# Altium schematic sheet Sheet1.SchDoc
size B
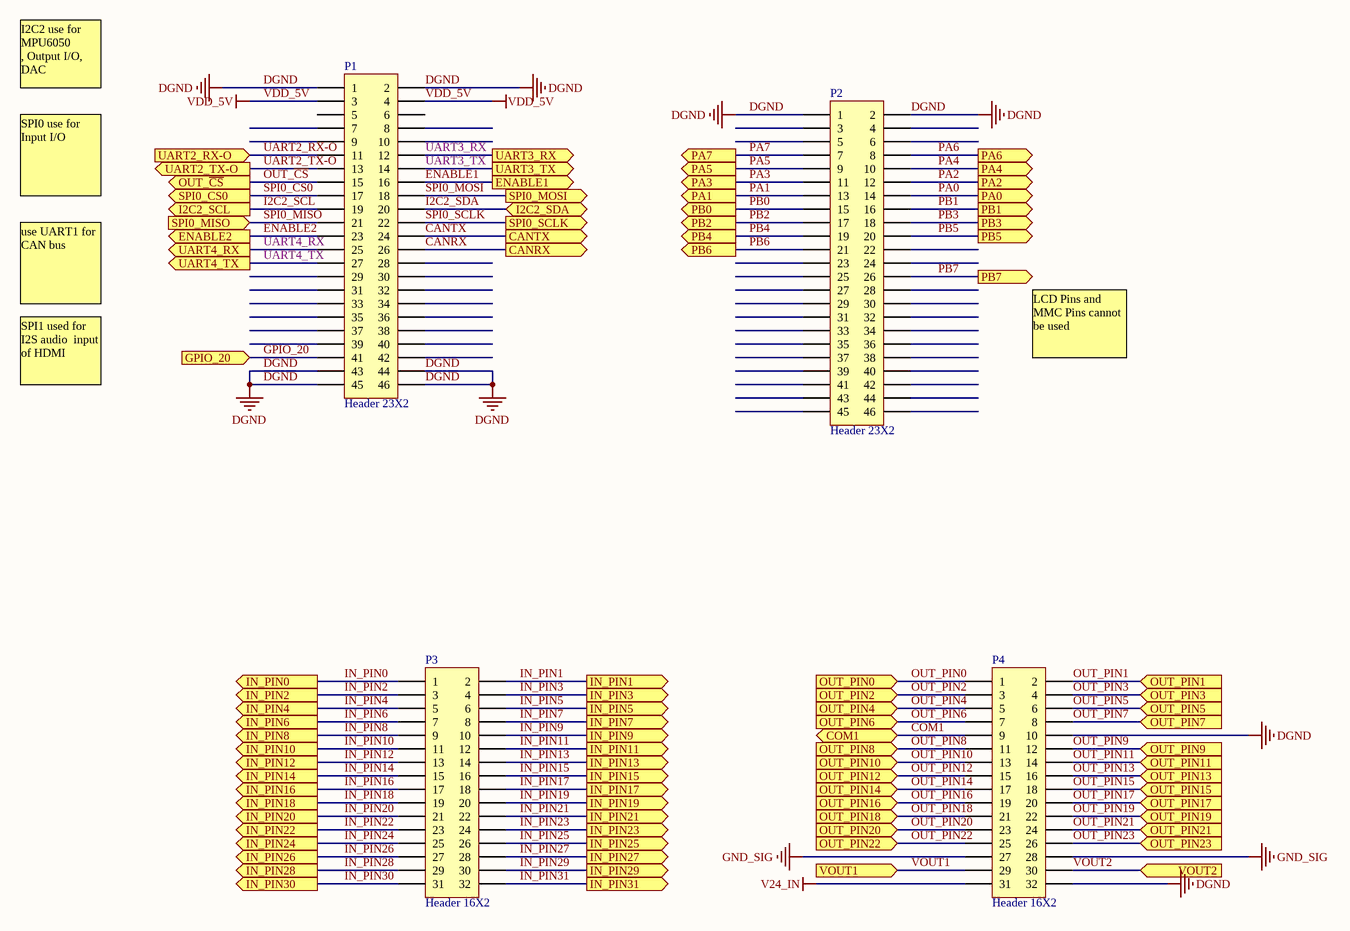
[diagram p0: Sheet1.SchDoc]

## Parts
P1  Header 23X2  [HDR2X23]
P2  Header 23X2  [HDR2X23]
P3  Header 16X2  [CON16X2-8.5]
P4  Header 16X2  [CON16X2-8.5]

## Ports
CANRX (out), CANTX (out), COM1, ENABLE1 (out), ENABLE2 (out), GPIO_20 (in), I2C2_SCL (out), I2C2_SDA (bidir), IN_PIN0 (out), IN_PIN1 (out), IN_PIN2 (out), IN_PIN3 (out), IN_PIN4 (out), IN_PIN5 (out), IN_PIN6 (out), IN_PIN7 (out), IN_PIN8 (out), IN_PIN9 (out), IN_PIN10 (out), IN_PIN11 (out), IN_PIN12 (out), IN_PIN13 (out), IN_PIN14 (out), IN_PIN15 (out), IN_PIN16 (out), IN_PIN17 (out), IN_PIN18 (out), IN_PIN19 (out), IN_PIN20 (out), IN_PIN21 (out), IN_PIN22 (out), IN_PIN23 (out), IN_PIN24 (out), IN_PIN25 (out), IN_PIN26 (out), IN_PIN27 (out), IN_PIN28 (out), IN_PIN29 (out), IN_PIN30 (out), IN_PIN31 (out), OUT_PIN0 (in), OUT_PIN1 (in), OUT_PIN2 (in), OUT_PIN3 (in), OUT_PIN4 (in), OUT_PIN5 (in), OUT_PIN6 (in), OUT_PIN7 (in), OUT_PIN8 (in), OUT_PIN9 (in), OUT_PIN10 (in), OUT_PIN11 (in), OUT_PIN12 (in), OUT_PIN13 (in), OUT_PIN14 (in), OUT_PIN15 (in), OUT_PIN16 (in), OUT_PIN17 (in), OUT_PIN18 (in), OUT_PIN19 (in), OUT_PIN20 (in), OUT_PIN21 (in), OUT_PIN22 (in), OUT_PIN23 (in), OUT_~{CS} (out), PA0 (out), PA1 (out), PA2 (out), PA3 (out), PA4 (out), PA5 (out), PA6 (out), PA7 (out), PB0 (out), PB1 (out), PB2 (out), PB3 (out), PB4 (out), PB5 (out), PB6 (out), PB7 (out), SPI0_CS0 (out), SPI0_MISO (in), SPI0_MOSI (out), SPI0_SCLK (out), UART2_RX-O (in), UART2_TX-O (out), UART3_RX (out), UART3_TX (out), UART4_RX (out), UART4_TX (out), VOUT1 (in), VOUT2 (in)

## Nets
DGND: P1.1 P1.2 P1.43 P1.44 P1.45 P1.46 P2.1 P2.2 P4.10 P4.32
GND_SIG: P4.27 P4.28
V24_IN: P4.31
VDD_5V: P1.3 P1.4
CANRX: P1.26 ; port CANRX
CANTX: P1.24 ; port CANTX
COM1: P4.9 ; port COM1
ENABLE1: P1.16 ; port ENABLE1
ENABLE2: P1.23 ; port ENABLE2
GPIO_20: P1.41 ; port GPIO_20
I2C2_SCL: P1.19 ; port I2C2_SCL
I2C2_SDA: P1.20 ; port I2C2_SDA
IN_PIN0: P3.1 ; port IN_PIN0
IN_PIN1: P3.2 ; port IN_PIN1
IN_PIN2: P3.3 ; port IN_PIN2
IN_PIN3: P3.4 ; port IN_PIN3
IN_PIN4: P3.5 ; port IN_PIN4
IN_PIN5: P3.6 ; port IN_PIN5
IN_PIN6: P3.7 ; port IN_PIN6
IN_PIN7: P3.8 ; port IN_PIN7
IN_PIN8: P3.9 ; port IN_PIN8
IN_PIN9: P3.10 ; port IN_PIN9
IN_PIN10: P3.11 ; port IN_PIN10
IN_PIN11: P3.12 ; port IN_PIN11
IN_PIN12: P3.13 ; port IN_PIN12
IN_PIN13: P3.14 ; port IN_PIN13
IN_PIN14: P3.15 ; port IN_PIN14
IN_PIN15: P3.16 ; port IN_PIN15
IN_PIN16: P3.17 ; port IN_PIN16
IN_PIN17: P3.18 ; port IN_PIN17
IN_PIN18: P3.19 ; port IN_PIN18
IN_PIN19: P3.20 ; port IN_PIN19
IN_PIN20: P3.21 ; port IN_PIN20
IN_PIN21: P3.22 ; port IN_PIN21
IN_PIN22: P3.23 ; port IN_PIN22
IN_PIN23: P3.24 ; port IN_PIN23
IN_PIN24: P3.25 ; port IN_PIN24
IN_PIN25: P3.26 ; port IN_PIN25
IN_PIN26: P3.27 ; port IN_PIN26
IN_PIN27: P3.28 ; port IN_PIN27
IN_PIN28: P3.29 ; port IN_PIN28
IN_PIN29: P3.30 ; port IN_PIN29
IN_PIN30: P3.31 ; port IN_PIN30
IN_PIN31: P3.32 ; port IN_PIN31
OUT_~{CS}: P1.15 ; port OUT_~{CS}
OUT_PIN0: P4.1 ; port OUT_PIN0
OUT_PIN1: P4.2 ; port OUT_PIN1
OUT_PIN2: P4.3 ; port OUT_PIN2
OUT_PIN3: P4.4 ; port OUT_PIN3
OUT_PIN4: P4.5 ; port OUT_PIN4
OUT_PIN5: P4.6 ; port OUT_PIN5
OUT_PIN6: P4.7 ; port OUT_PIN6
OUT_PIN7: P4.8 ; port OUT_PIN7
OUT_PIN8: P4.11 ; port OUT_PIN8
OUT_PIN9: P4.12 ; port OUT_PIN9
OUT_PIN10: P4.13 ; port OUT_PIN10
OUT_PIN11: P4.14 ; port OUT_PIN11
OUT_PIN12: P4.15 ; port OUT_PIN12
OUT_PIN13: P4.16 ; port OUT_PIN13
OUT_PIN14: P4.17 ; port OUT_PIN14
OUT_PIN15: P4.18 ; port OUT_PIN15
OUT_PIN16: P4.19 ; port OUT_PIN16
OUT_PIN17: P4.20 ; port OUT_PIN17
OUT_PIN18: P4.21 ; port OUT_PIN18
OUT_PIN19: P4.22 ; port OUT_PIN19
OUT_PIN20: P4.23 ; port OUT_PIN20
OUT_PIN21: P4.24 ; port OUT_PIN21
OUT_PIN22: P4.25 ; port OUT_PIN22
OUT_PIN23: P4.26 ; port OUT_PIN23
PA0: P2.14 ; port PA0
PA1: P2.13 ; port PA1
PA2: P2.12 ; port PA2
PA3: P2.11 ; port PA3
PA4: P2.10 ; port PA4
PA5: P2.9 ; port PA5
PA6: P2.8 ; port PA6
PA7: P2.7 ; port PA7
PB0: P2.15 ; port PB0
PB1: P2.16 ; port PB1
PB2: P2.17 ; port PB2
PB3: P2.18 ; port PB3
PB4: P2.19 ; port PB4
PB5: P2.20 ; port PB5
PB6: P2.21 ; port PB6
PB7: P2.26 ; port PB7
SPI0_CS0: P1.17 ; port SPI0_CS0
SPI0_MISO: P1.21 ; port SPI0_MISO
SPI0_MOSI: P1.18 ; port SPI0_MOSI
SPI0_SCLK: P1.22 ; port SPI0_SCLK
UART2_RX-O: P1.11 ; port UART2_RX-O
UART2_TX-O: P1.13 ; port UART2_TX-O
UART3_RX: P1.12 ; port UART3_RX
UART3_TX: P1.14 ; port UART3_TX
UART4_RX: P1.25 ; port UART4_RX
UART4_TX: P1.27 ; port UART4_TX
VOUT1: P4.29 ; port VOUT1
VOUT2: P4.30 ; port VOUT2

Not connected (* = marked no-connect by the designer): P1 5 6 7 8 9 10 28 29 30 31 32 33 34 35 36 37 38 39 40 42; P2 3 4 5 6 22 23 24 25 27 28 29 30 31 32 33 34 35 36 37 38 39 40 41 42 43 44 45 46

## Notes on the sheet
- I2C2 use for MPU6050
  , Output I/O, DAC
- SPI0 use for Input I/O
- use UART1 for CAN bus
- LCD Pins and MMC Pins cannot be used
- SPI1 used for  I2S audio  input of HDMI

## Library data of the parts
P1 P2 = Header 23X2: Header, 23-Pin, Dual row; LatestRevisionDate: 17-Jul-2002; LatestRevisionNote: Re-released for DXP Platform.; Publisher: Altium Limited
P3 P4 = Header 16X2: Header, 16-Pin, Dual row; LatestRevisionDate: 17-Jul-2002; LatestRevisionNote: Re-released for DXP Platform.; Publisher: Altium Limited